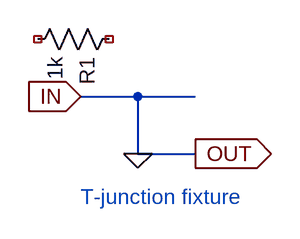
[diagram p0: schematic t-junction.asc]
t-junction.asc, the LTspice schematic file:
Version 4
SHEET 1 400 300
WIRE 0 0 128 0
WIRE 64 0 64 64
WIRE 64 64 128 64
FLAG 0 0 IN
IOPIN 0 0 In
FLAG 128 64 OUT
IOPIN 128 64 Out
FLAG 64 64 0
SYMBOL res 48 -80 R90
SYMATTR InstName R1
SYMATTR Value 1k
TEXT 0 112 Left 2 ;T-junction fixture

The netlist it stands for:
* t-junction.asc
R1 NC_01 NC_02 1k
* T-junction fixture
.backanno
.end